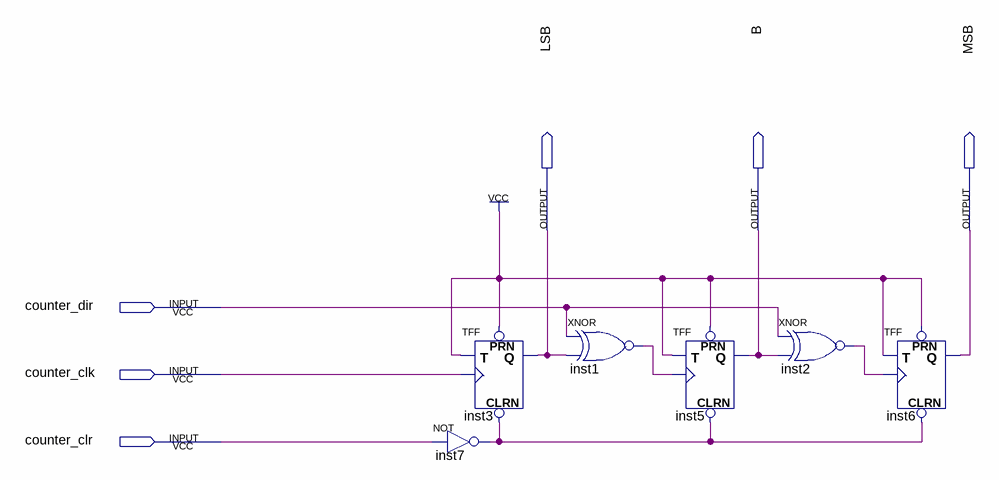
[diagram p0: schematic sheet]
// Quartus schematic counter.bdf as structural Verilog: 6 symbols, 6 pins
module counter (
  input  counter_dir,
  input  counter_clk,
  input  counter_clr,
  output LSB,
  output B,
  output MSB
);

  wire inst1_out, inst2_out, inst7_out;

  TFF inst3 (.PRN(1'b1), .CLRN(inst7_out), .T(1'b1), .CLK(counter_clk), .Q(LSB));
  not inst7 (inst7_out, counter_clr);
  xnor inst1 (inst1_out, counter_dir, LSB);
  TFF inst5 (.PRN(1'b1), .CLRN(inst7_out), .T(1'b1), .CLK(inst1_out), .Q(B));
  xnor inst2 (inst2_out, counter_dir, B);
  TFF inst6 (.PRN(1'b1), .CLRN(inst7_out), .T(1'b1), .CLK(inst2_out), .Q(MSB));
endmodule
